# EAGLE design RJ45x5 (EAGLE 7.4.0)
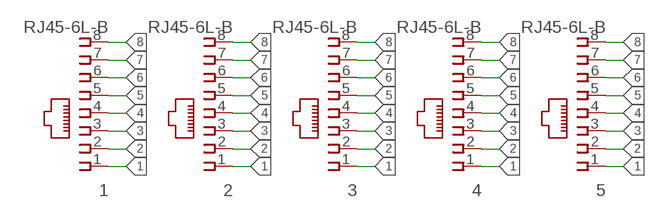
[diagram p0: schematic, sheet 1]

## Parts
1  RJ45-6L-B  [RJ45-NO-SHIELD]
2  RJ45-6L-B  [RJ45-NO-SHIELD]
3  RJ45-6L-B  [RJ45-NO-SHIELD]
4  RJ45-6L-B  [RJ45-NO-SHIELD]
5  RJ45-6L-B  [RJ45-NO-SHIELD]

## Nets
1: 1.1 2.1 3.1 4.1 5.1
2: 1.2 2.2 3.2 4.2 5.2
3: 1.3 2.3 3.3 4.3 5.3
4: 1.4 2.4 3.4 4.4 5.4
5: 1.5 2.5 3.5 4.5 5.5
6: 1.6 2.6 3.6 4.6 5.6
7: 1.7 2.7 3.7 4.7 5.7
8: 1.8 2.8 3.8 4.8 5.8

## Library data of the parts
1-5 = con-tycoelectronics:RJ45: CORCOM Modular RJ Jacks No Shield Source: www.tycoelectronics.com .. ENG_DS_1654001_1099_RJ_L_0507.pdf; MPN: RJ45-6L-B; OC_FARNELL: unknown; OC_NEWARK: 16R6090

## Board
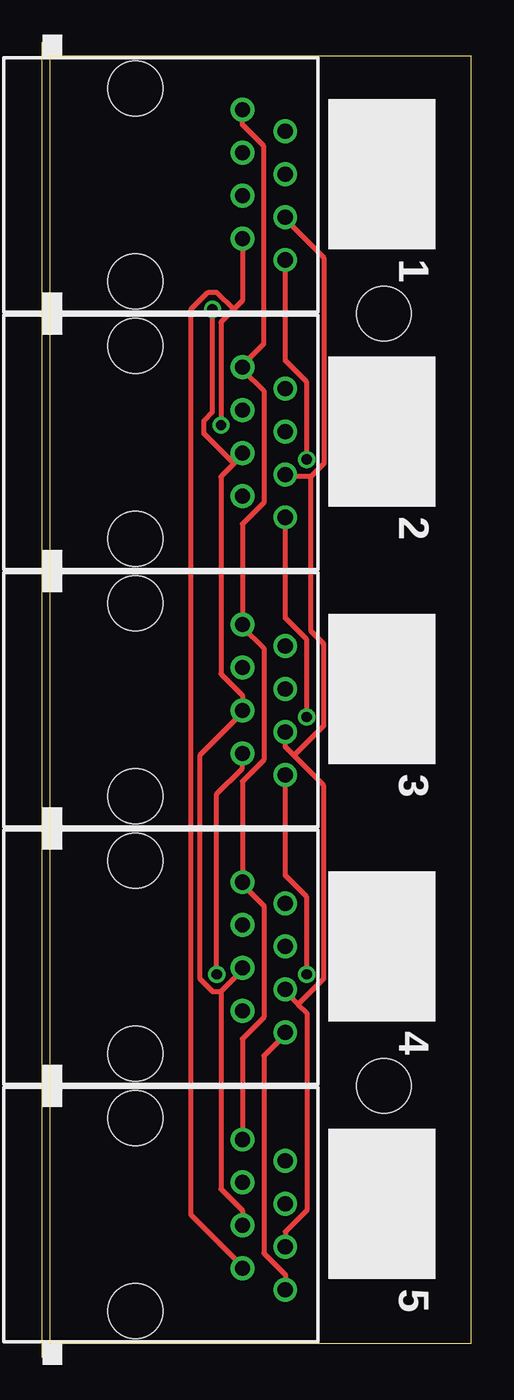
[diagram p1: board, top side]
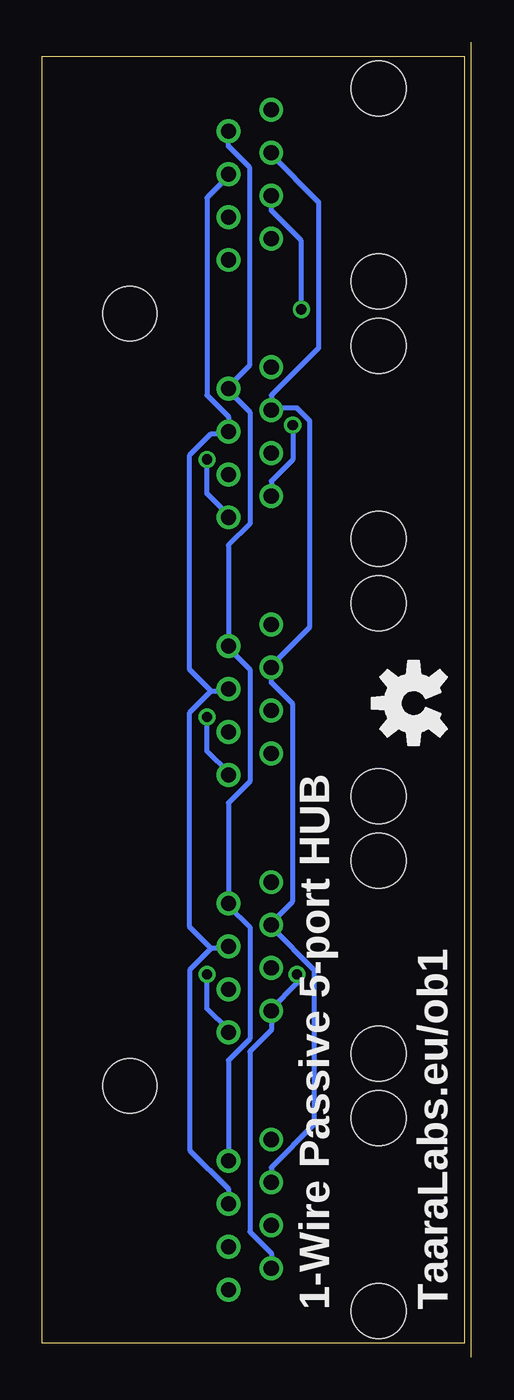
[diagram p2: board, bottom side, seen from below]

Size 25 x 76.19 mm. Coordinates in mm from the lower left corner, seen from the top.
Outline: 0,0 25,0 25,76.19 0,76.19 0,0
Copper layers (1*16): Top 0.035mm / dielectric 1.5mm / Bottom 0.035mm
Design rules "default *": minimum track width 12mil, minimum drill 24mil, track to track 8mil, track to pad 8mil, pad to pad 8mil, via to via 8mil, smd to smd 8mil, copper to edge 40mil, drill to drill 8mil, minimum pad ring 10mil, minimum via ring 8mil, stop-mask expansion 4mil, vias tented up to drill 0mil, thermal gap 10mil
Holes 3.2 mm at 19.81,60.96 19.81,15.24

### Footprints (pad centres in the part's own frame; a part is rotated, then mirrored left to right if it is on the bottom)
RJ45-NO-SHIELD = drill 0.9 pad 1.4: 1 -4.445,6.35; 2 -3.175,8.89; 3 -1.905,6.35; 4 -0.635,8.89; 5 0.635,6.35; 6 1.905,8.89; 7 3.175,6.35; 8 4.445,8.89 | hole 3.251: -5.715,0; 5.715,0

### Placement (x,y rotation side)
1  5.08,7.62 270 top
2  5.08,22.86 270 top
3  5.08,38.1 270 top
4  5.08,53.34 270 top
5  5.08,68.58 270 top
U$1  [OSHW-LOGO-M]  3,37.9 90 bottom

### Tracks (layer width: path | path; a pad name or v marks a point on that pad's centre or on a via)
1
  Top 0.305: 1.1 11.43,18.03 12.7,19.3 12.7,25.91 11.43,27.18 2.1 11.43,33.27 12.7,34.54 12.7,41.15 11.43,42.42 3.1 11.43,48.51 12.7,49.78 12.7,56.39 11.43,57.66 4.1 11.43,57.91 12.7,59.18 12.7,70.87 11.43,72.14 5.1
2
  Bottom 0.305: 1.2 13.97,16.76 12.7,18.03 12.7,24.64 13.97,25.91 2.2 13.97,32 12.7,33.27 12.7,39.88 13.97,41.15 3.2 13.97,47.24 12.7,48.51 12.7,55.12 13.97,56.39 4.2 13.97,56.64 12.7,57.91 12.7,69.6 13.97,70.87 5.2
3
  Bottom 0.305: 11.43,55.37 11.43,56.13 8.64,58.93 8.64,67.56 11.43,70.36 5.3 | 1.3 11.43,10.41 8.89,12.95 8.89,22.1 11.43,24.64 2.3 11.43,24.89 10.16,26.16 10.16,37.85 11.43,39.12 3.3 11.43,40.13 9.14,42.42 9.14,54.61 9.91,55.37 11.43,55.37 | 11.43,55.37 4.3
4
  Bottom 0.305: 5.4 13.97,69.09 15.24,67.82 15.24,56.13 13.97,54.86 4.4 13.97,53.85 14.99,53.85 16.26,52.58 16.26,39.88 14.99,38.61 | 1.4 13.97,9.14 16.26,11.43 16.26,22.1 14.99,23.37 | 14.99,23.37 13.97,23.37 2.4 | 14.99,38.61 13.97,38.61 3.4 | 14.99,38.61 16.26,37.34 16.26,24.64 14.99,23.37
5  (via drill 0.61)
  Top 0.305: 1.5 11.43,7.87 10.16,9.14 10.16,20.83 | 10.16,20.83 11.43,22.1 2.5 | 10.92,52.07 11.43,52.58 4.5 | 10.92,52.07 10.16,51.31 10.16,39.62 11.43,38.35 3.5 11.43,37.34 8.89,34.8 8.89,21.59 9.65,20.83 10.16,20.83 | v9.65,61.21 9.65,55.12 9.14,54.61 9.14,53.85 10.92,52.07
  Bottom 0.305: 5.5 11.43,67.06 9.65,65.28 v9.65,61.21
6
  Top 0.305: 15.49,51.31 13.97,51.31 4.6 | 15.49,51.31 16.26,52.07 16.26,64.26 13.97,66.55 5.6 | 1.6 13.97,6.6 15.24,7.87 15.24,19.56 14.73,20.07 | 14.73,20.07 13.97,20.83 2.6 | 3.6 13.97,35.31 14.48,34.8 | 14.48,34.8 16.26,33.02 16.26,21.59 14.73,20.07 | 15.49,51.31 15.49,42.16 16.26,41.4 16.26,36.58 14.48,34.8
7  (via drill 0.61)
  Top 0.305: v10.16,54.36 10.16,60.45 10.92,61.21 | 10.92,61.21 11.43,61.72 5.7 | 3.7 11.43,34.04 9.91,32.51 v9.91,21.84 | 10.92,61.21 9.91,62.23 9.4,62.23 8.38,61.21 8.38,7.62 11.43,4.57 1.7
  Bottom 0.305: 4.7 11.43,51.05 10.16,52.32 v10.16,54.36 | 1.7 11.43,5.33 12.7,6.6 12.7,17.27 11.43,18.54 2.7 11.43,19.81 9.91,21.34 v9.91,21.84
8  (via drill 0.61)
  Top 0.305: 1.8 13.97,4.06 12.7,5.33 12.7,17.02 13.97,18.29 2.8 | 3.8 13.97,27.69 15.24,26.42 v15.24,21.84 | 4.8 13.97,42.93 15.24,41.66 v15.24,37.08 | 5.8 13.97,58.17 15.24,56.9 v15.24,52.32
  Bottom 0.305: v15.24,21.84 15.24,19.81 13.97,18.54 2.8 | v15.24,37.08 15.24,35.05 13.97,33.78 3.8 | v15.24,52.32 15.24,50.29 13.97,49.02 4.8

### Text on the board
tNames: 1 | 2 | 3 | 4 | 5
bNames: TaaraLabs.eu/ob1 | 1-Wire Passive 5-port HUB